# EAGLE schematic cv02dobes (EAGLE 7.7.0)
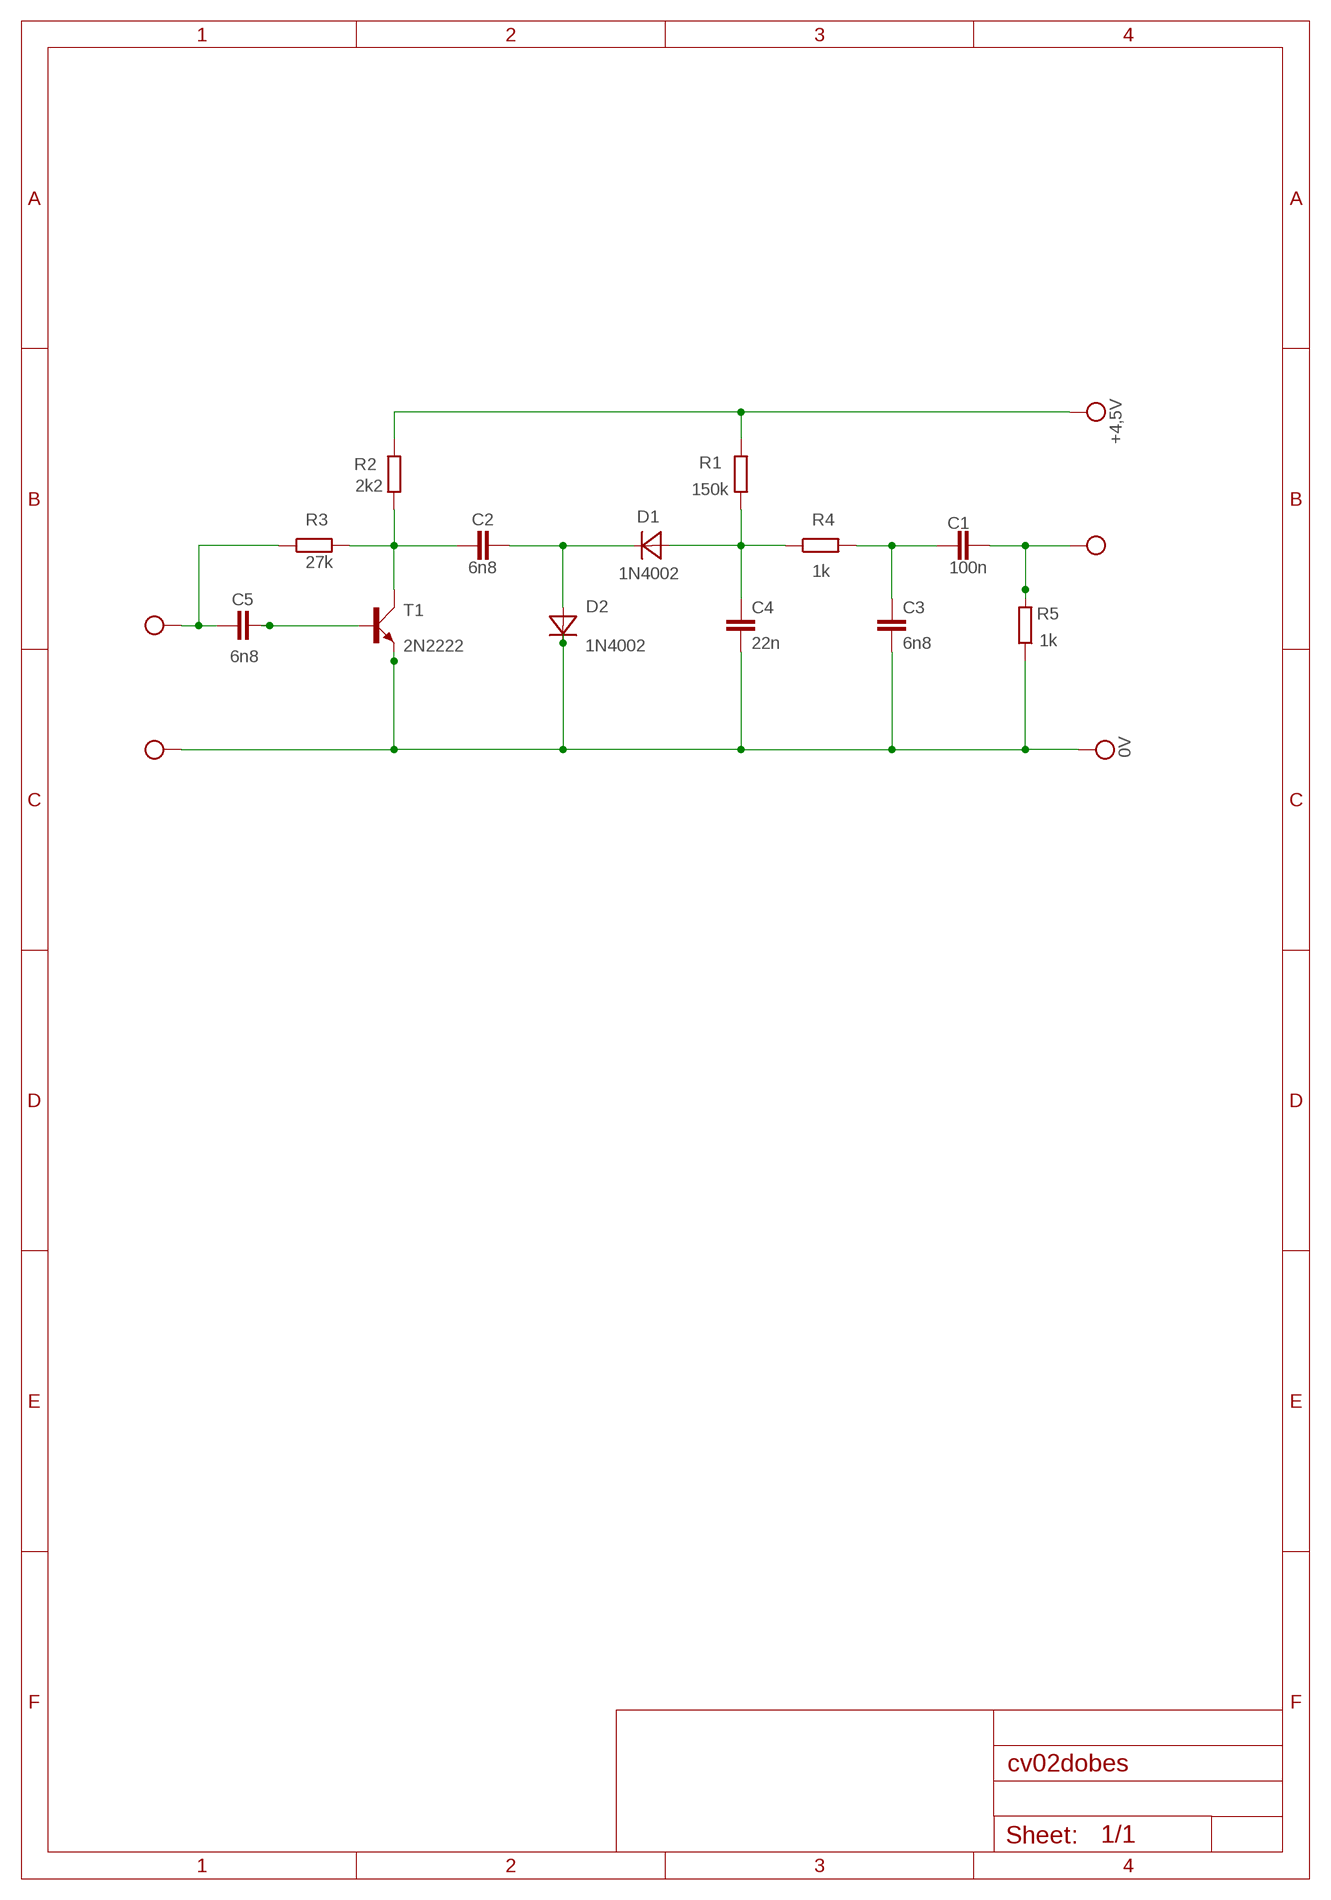
[diagram p0: schematic, sheet 1]

## Parts
C1  100n  C-EUHPC0201  [HPC0201]
C2  6n8  C-EUHPC0201  [HPC0201]
C3  6n8  C-EUHPC0201  [HPC0201]
C4  22n  C-EUHPC0201  [HPC0201]
C5  6n8  C-EUHPC0201  [HPC0201]
D1  1N4002  MBRA340T3  [SMA]
D2  1N4002  MBRA340T3  [SMA]
R1  150k  R-EU_WSC6927  [WSC6927]
R2  2k2  R-EU_WSC6927  [WSC6927]
R3  27k  R-EU_WSC6927  [WSC6927]
R4  1k  R-EU_WSC6927  [WSC6927]
R5  1k  R-EU_WSC6927  [WSC6927]
T1  2N2222  BFR90  [SOT37]

## Nets
N$1: C4.1 D1.A R1.1 R4.1
N$3: C1.1 C3.1 R4.2
N$4: C2.2 D1.C D2.A
N$5: C2.1 R2.1 R3.2 T1.1(C)
N$8: C5.2 T1.3(B)
VPP: C1.2 C3.2 C4.2 C5.1 D2.C R1.2 R2.2 R3.1 R5.1 R5.2 T1.2(E) ; supply symbol labelled +4,5V, 0V

## Library data of the parts
C1-C5 = resistor:C-EU: CAPACITOR, European symbol
D1 D2 = diode:MBRA340T3: Surface Mount Schottky Power Rectifier Source: http://www.onsemi.com/pub_link/Collateral/MBRA340T3-D.PDF
R1-R5 = resistor:R-EU_: RESISTOR, European symbol
T1 = transistor-small-signal:BFR90: NPN TRANSISTOR